# EAGLE design Hub_Teensy3_ElecImp_V002 (EAGLE 6.4)
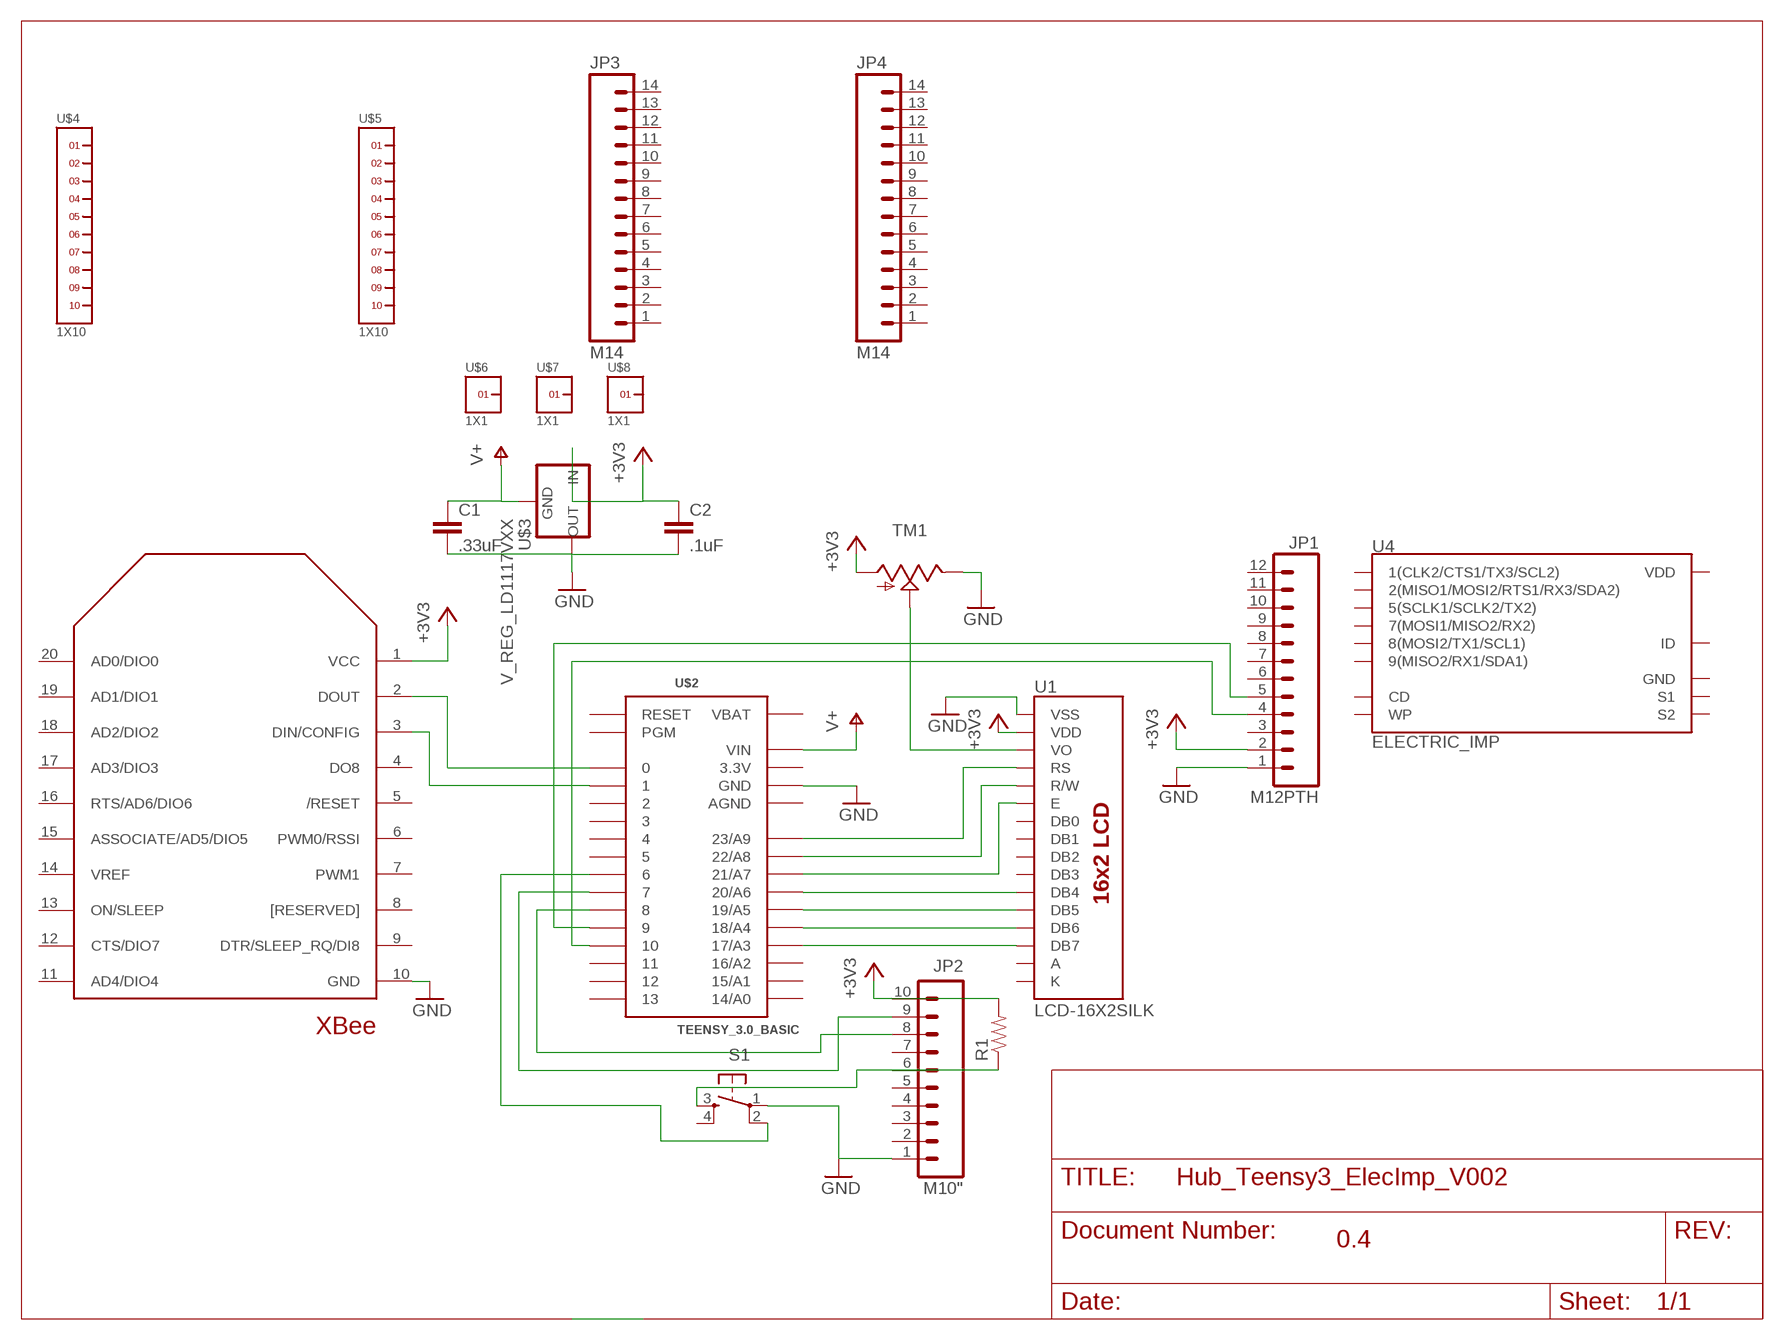
[diagram p0: schematic, sheet 1]

## Parts
C1  .33uF  1UF-25V-10%(0805)  [0805]
C2  .1uF  1UF-25V-10%(0805)  [0805]
JP1  M12PTH  [1X12]
JP2  M10"  [1X10]
JP3  M14  [1X14]
JP4  M14  [1X14]
R1  RESISTORPTH-1/4W  [AXIAL-0.4]
S1  TAC_SWITCHPTH  [TACTILE-PTH]
TM1  TRIM  [6MM]
U1  LCD-16X2SILK  [LCD-16X2]
U4  ELECTRIC_IMP  [SD_MMC_SOCKET]
U$1  XBEE  [XBEE]
U$2  TEENSY_3.0_BASIC  [TEENSY_3.0_BASIC]
U$3  V_REG_LD1117VXX  [78XXL]
U$4  1X10  [1X10]
U$5  1X10  [1X10]
U$6  1X1  [1X1]
U$7  1X1  [1X1]
U$8  1X1  [1X1]

## Nets
+3V3: C2.1 JP1.2 JP2.10 R1.P$2 TM1.A U1.2(VDD) U$1.1(VCC) U$3.OUT(IN)
GND: C1.2 C2.2 JP1.1 JP2.1 S1.1 TM1.E U1.1(VSS) U$1.10(GND) U$2.GND U$2.GND1(GND) U$3.GND(OUT)
N$1: U1.11(DB4) U$2.20/A6
N$2: U1.12(DB5) U$2.19/A5
N$3: U1.13(DB6) U$2.18/A4
N$4: U1.6(E) U$2.21/A7
N$5: U1.4(RS) U$2.23/A9
N$6: U1.5(R/W) U$2.22/A8
N$8: JP1.5 U$2.9
N$9: JP1.4 U$2.10
N$10: U1.14(DB7) U$2.17/A3
N$11: JP2.8 U$2.8
N$12: U$1.3(DIN/CONFIG) U$2.1
N$13: JP2.9 U$2.7
N$14: TM1.S U1.3(VO)
N$17: U$1.2(DOUT) U$2.0
N$19: JP2.6 R1.P$1 S1.3
N$20: S1.2 U$2.6
V+: C1.1 U$2.VIN U$3.IN(GND)
Unconnected: JP1.3 JP1.6 JP1.7 JP1.8 JP1.9 JP1.10 JP1.11 JP1.12 JP2.2 JP2.3 JP2.4 JP2.5 JP2.7 JP3.1 JP3.2 JP3.3 JP3.4 JP3.5 JP3.6 JP3.7 JP3.8 JP3.9 JP3.10 JP3.11 JP3.12 JP3.13 JP3.14 JP4.1 JP4.2 JP4.3 JP4.4 JP4.5 JP4.6 JP4.7 JP4.8 JP4.9 JP4.10 JP4.11 JP4.12 JP4.13 JP4.14 S1.4 U1.7(DB0) U1.8(DB1) U1.9(DB2) U1.10(DB3) U4.1(1(CLK2/CTS1/TX3/SCL2)) U4.2(2(MISO1/MOSI2/RTS1/RX3/SDA2)) U4.3(GND) U4.4(VDD) U4.5(5(SCLK1/SCLK2/TX2)) U4.6(ID) U4.7(7(MOSI1/MISO2/RX2)) U4.8(8(MOSI2/TX1/SCL1)) U4.9(9(MISO2/RX1/SDA1)) U4.CD U4.S1 U4.S2 U4.WP U$1.4(DO8) U$1.5(/RESET) U$1.6(PWM0/RSSI) U$1.7(PWM1) U$1.8([RESERVED]) U$1.9(DTR/SLEEP_RQ/DI8) U$1.11(AD4/DIO4) U$1.12(CTS/DIO7) U$1.13(ON/SLEEP) U$1.14(VREF) U$1.15(ASSOCIATE/AD5/DIO5) U$1.16(RTS/AD6/DIO6) U$1.17(AD3/DIO3) U$1.18(AD2/DIO2) U$1.19(AD1/DIO1) U$1.20(AD0/DIO0) U$2.2 U$2.3 U$2.4 U$2.5 U$2.11 U$2.12 U$2.13 U$2.14/A0 U$2.15/A1 U$2.16/A2 U$2.PGM U$2.RESET U$4.1 U$4.2 U$4.3 U$4.4 U$4.5 U$4.6 U$4.7 U$4.8 U$4.9 U$4.10 U$5.1 U$5.2 U$5.3 U$5.4 U$5.5 U$5.6 U$5.7 U$5.8 U$5.9 U$5.10 U$6.1 U$7.1 U$8.1

## Notes on the sheet
- 0.4

## Power pins joined to a net without a drawn wire
3.3V: U$2.3.3V U$2.3.3V1(3.3V)
A: U1.15(A)
AGND: U$2.AGND
K: U1.16(K)
VBAT: U$2.VBAT

## Library data of the parts
C1 C2 = SparkFun-Capacitors:1UF-25V-10%(0805): CAP-08064; PROD_ID: CAP-08064; VALUE: 1uF
JP1 = SparkFun-Connectors:M12: Header 12 Standard 12-pin 0.1" header. Use with straight break away headers (SKU : PRT-00116), right angle break away headers (PRT-00553), swiss pins (PRT-00743), machine pins (PRT-00117), and female headers (PRT-00115).
JP2 = SparkFun-Connectors:M10: Header 10 Standard 10-pin 0.1" header. Use with straight break away headers (SKU : PRT-00116), right angle break away headers (PRT-00553), swiss pins (PRT-00743), machine pins (PRT-00117), and female headers (PRT-00115).
JP3 JP4 = SparkFun-Connectors:M14: Header 14 Standard 14-pin 0.1" header. Use with straight break away headers (SKU : PRT-00116), right angle break away headers (PRT-00553), swiss pins (PRT-00743), machine pins (PRT-00117), and female headers (PRT-00115).
R1 = SparkFun-Passives:RESISTOR: Resistor Basic schematic elements and footprints for 0603, 1206, and PTH resistors.
S1 = SparkFun-Electromechanical:TAC_SWITCH: Momentary Switch Button commonly used for reset or general input. Spark Fun Electronics SKU : COM-00097 SMT- SWCH-08247
TM1 = adafruit:TRIM
U1 = SparkFun-Displays:LCD-16X2: Standard text-only 16x2 parallel input LCD
U4 = SparkFun-RF:ELECTRIC_IMP: Electric Imp SD Socket This symbol matches the Electric Imp <https://www.sparkfun.com/products/11395> pinout to a 4UCONN SD MMC connector. The 4UCONN part number is 19646 <http://www.4uconnector.com/online/Itemadrawing.asp?fldseries=19646&seriesno_a=12>. See this part in action on the Electric Imp Breakout <https://www.sparkfun.com/products/11400>.
U$1 = CEDT:XBEE
U$2 = Teensy3-2.0:TEENSY_3.0_BASIC: Basic Teensy 3.0 with none of the 'inner' pins enabled. See '+4', 'AllAnalogPins", and 'AllPins' packages for additional pin holes, as needed.
U$3 = SparkFun-PowerIC:V_REG_LD1117VXX: LD1117VXX voltage regulator. We carry the 3.3V version (COM-00526) in TO-220 package.
U$4 U$5 = headers(2mm)(samtec):1X10
U$6-U$8 = headers(.1in):1X1

## Board
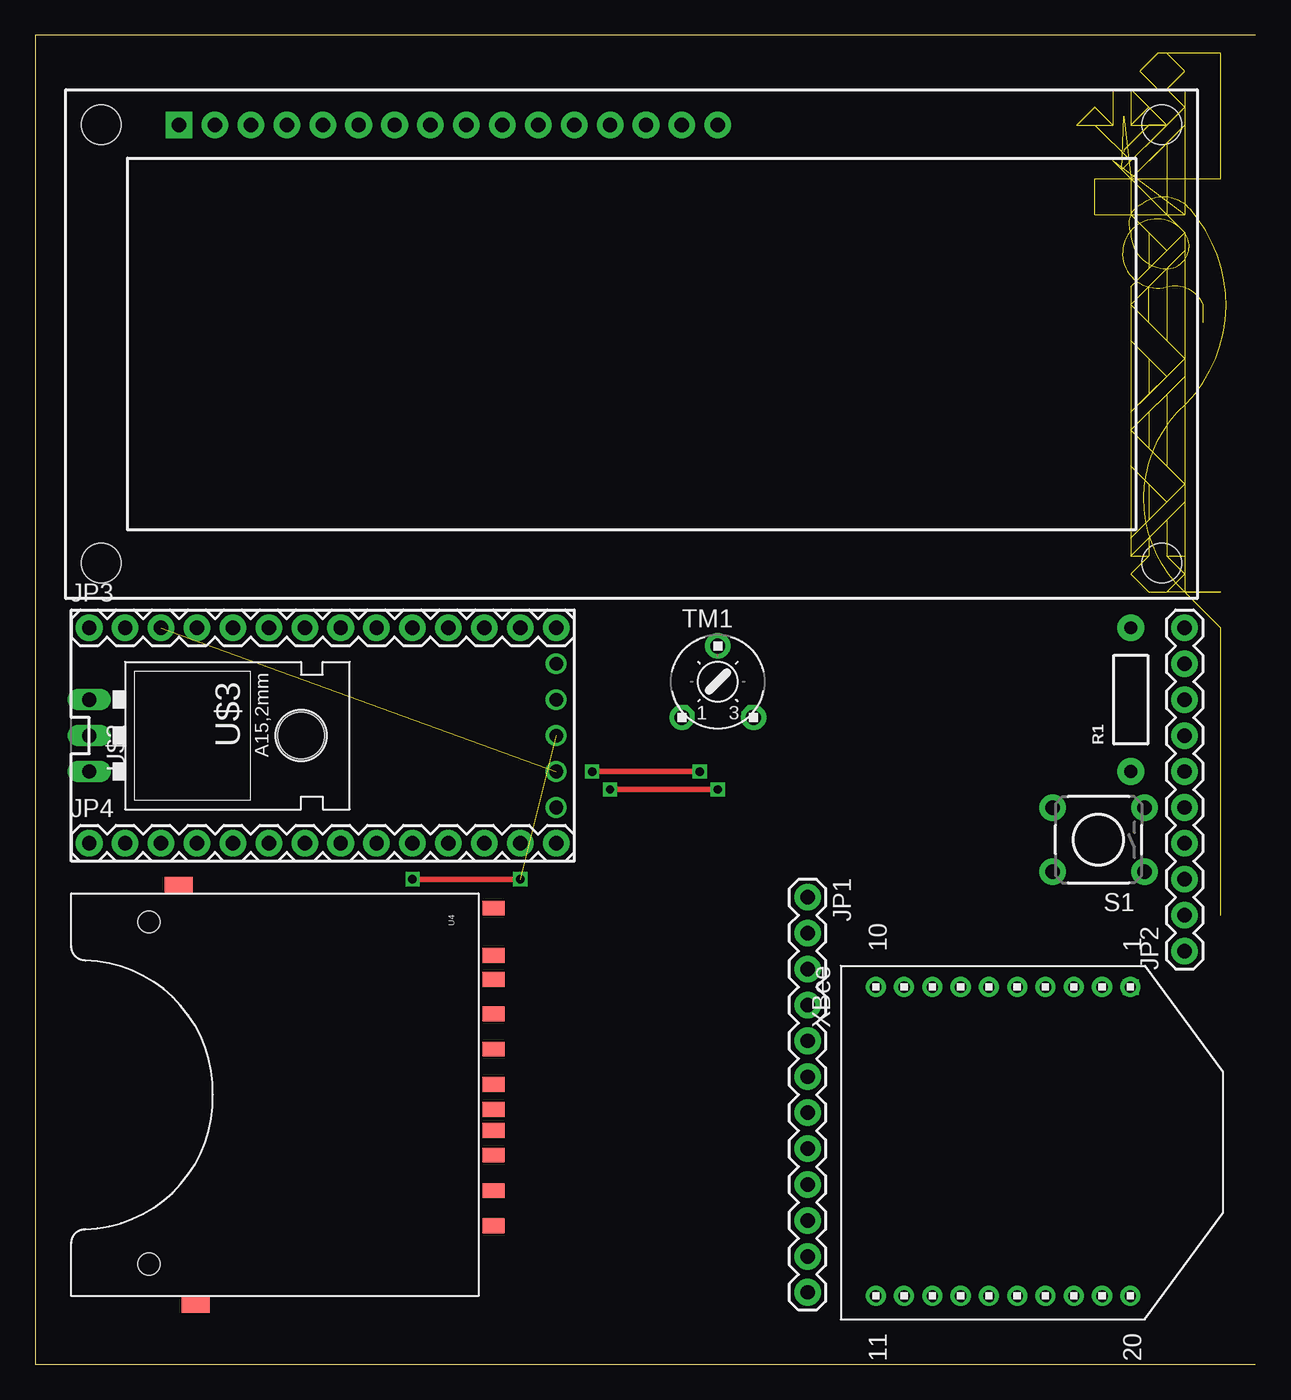
[diagram p1: board, top side]
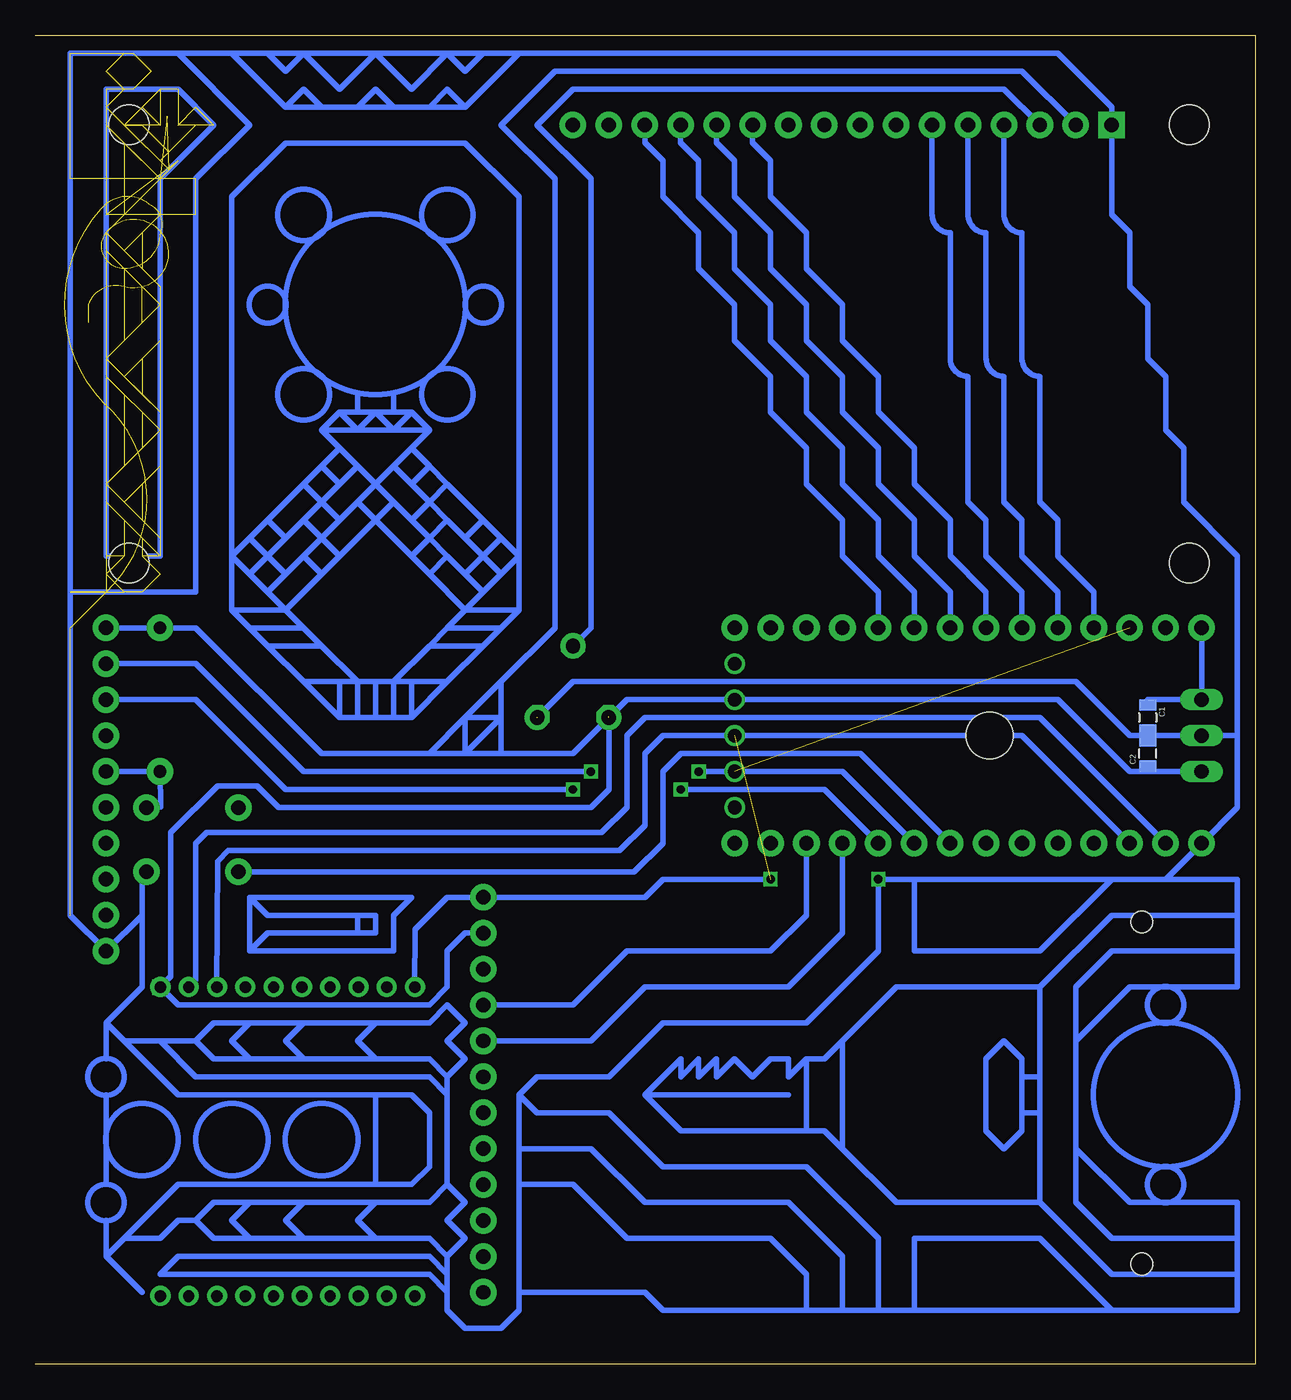
[diagram p2: board, bottom side, seen from below]

Size 86.28 x 93.97 mm. Coordinates in mm from the lower left corner, seen from the top.
Outline: 86.28,0 0,0 0,93.97 86.28,93.97
Copper layers (1*16): Top 0.035mm / dielectric 1.5mm / Bottom 0.035mm
Design rules "default": minimum track width 10mil, minimum drill 24mil, track to track 8mil, track to pad 8mil, pad to pad 8mil, via to via 8mil, smd to smd 8mil, copper to edge 40mil, drill to drill 8mil, minimum pad ring 10mil, minimum via ring 8mil, stop-mask expansion 4mil, vias tented up to drill 0mil, thermal gap 10mil

### Footprints (pad centres in the part's own frame; a part is rotated, then mirrored left to right if it is on the bottom)
0805 = smd 0.8 x 1.2: 1 -0.9,0; 2 0.9,0
1X12 = drill 1.016 pad 1.88: 1 0,0; 2 2.54,0; 3 5.08,0; 4 7.62,0; 5 10.16,0; 6 12.7,0; 7 15.24,0; 8 17.78,0; 9 20.32,0; 10 22.86,0; 11 25.4,0; 12 27.94,0
1X10 = drill 1.016 pad 1.88: 1 0,0; 2 2.54,0; 3 5.08,0; 4 7.62,0; 5 10.16,0; 6 12.7,0; 7 15.24,0; 8 17.78,0; 9 20.32,0; 10 22.86,0
1X14 = drill 1.016 pad 1.88: 1 0,0; 2 2.54,0; 3 5.08,0; 4 7.62,0; 5 10.16,0; 6 12.7,0; 7 15.24,0; 8 17.78,0; 9 20.32,0; 10 22.86,0; 11 25.4,0; 12 27.94,0; 13 30.48,0; 14 33.02,0
AXIAL-0.4 = drill 0.9 pad 1.88: P$1 -5.08,0; P$2 5.08,0
TACTILE-PTH = drill 1.016 pad 1.88: 1 -3.251,2.261; 2 3.251,2.261; 3 -3.251,-2.261; 4 3.251,-2.261
6MM = drill 1 pad 1.676 octagon: A -2.5,-2.5; E 2.5,-2.5; S 0,2.5
LCD-16X2 = drill 1.016 pad 1.88 square: 1 -32,15.5 | drill 1.016 pad 1.88: 2 -29.46,15.5; 3 -26.92,15.5; 4 -24.38,15.5; 5 -21.84,15.5; 6 -19.3,15.5; 7 -16.76,15.5; 8 -14.22,15.5; 9 -11.68,15.5; 10 -9.14,15.5; 11 -6.6,15.5; 12 -4.06,15.5; 13 -1.52,15.5; 14 1.02,15.5; 15 3.56,15.5; 16 6.1,15.5 | hole 2.8: -37.5,15.5; -37.5,-15.5; 37.5,15.5; 37.5,-15.5
SD_MMC_SOCKET = smd 1.05 x 1.56: 1 6.77,29.87; 2 4.27,29.87; 3 2.52,29.87; 4 -0.73,29.87; 5 -3.23,29.87; 6 -5.73,29.87; 7 -8.15,29.87; 8 -9.85,29.87; 9 9.27,29.87; CD 1.02,29.87; WP -13.2,29.87 | smd 1.2 x 2: S1 -14.8,7.6; S2 14.8,8.8 | hole 1.55: 11.98,5.5; -12.22,5.5
XBEE = drill 0.6 square: 1 0,0 | drill 0.6: 2 0,-2; 3 0,-4; 4 0,-6; 5 0,-8; 6 0,-10; 7 0,-12; 8 0,-14; 9 0,-16; 10 0,-18; 11 22,-18; 12 22,-16; 13 22,-14; 14 22,-12; 15 22,-10; 16 22,-8; 17 22,-6; 18 22,-4; 19 22,-2; 20 22,0
TEENSY_3.0_BASIC = drill 0.965: 0 -7.62,13.97; 1 -7.62,11.43; 2 -7.62,8.89; 3 -7.62,6.35; 3.3V 7.62,11.43; 3.3V1 -2.54,-16.51; 4 -7.62,3.81; 5 -7.62,1.27; 6 -7.62,-1.27; 7 -7.62,-3.81; 8 -7.62,-6.35; 9 -7.62,-8.89; 10 -7.62,-11.43; 11 -7.62,-13.97; 12 -7.62,-16.51; 13 7.62,-16.51; 14/A0 7.62,-13.97; 15/A1 7.62,-11.43; 16/A2 7.62,-8.89; 17/A3 7.62,-6.35; 18/A4 7.62,-3.81; 19/A5 7.62,-1.27; 20/A6 7.62,1.27; 21/A7 7.62,3.81; 22/A8 7.62,6.35; 23/A9 7.62,8.89; AGND 7.62,13.97; GND -7.62,16.51; GND1 0,-16.51; PGM 2.54,-16.51; RESET 5.08,-16.51; VBAT -5.08,-16.51; VIN 7.62,16.51
78XXL = drill 1.016 long: GND 0,-3.81; IN -2.54,-3.81; OUT 2.54,-3.81 | hole 3.302: 0,11.176
1X10' = drill 0.8 pad 1.422: 1 0,0; 2 2,0; 3 4,0; 4 6,0; 5 8,0; 6 10,0; 7 12,0; 8 14,0; 9 16,0; 10 18,0
1X1 = drill 1.016 pad 1.778: 1 0,0

### Placement (x,y rotation side)
C1  7.62,45.72 270 bottom
C2  7.62,43.18 90 bottom
JP1  54.61,33.02 270 top
JP2  81.28,29.21 90 top
JP3  3.81,52.07 0 top
JP4  3.81,36.83 0 top
R1  77.47,46.99 90 top
S1  75.18,37.08 180 top
TM1  48.26,48.26 0 top
U1  42.16,72.14 0 top
U4  2.54,19.05 270 top
U$1  77.47,26.67 270 top
U$2  20.32,44.45 90 top
U$3  7.62,44.45 270 top
U$4  1X10  [1X10']  59.44,26.67 0 top
U$5  1X10  [1X10']  59.44,4.83 0 top
U$6  48.26,50.8 0 top
U$7  50.8,45.72 0 top
U$8  45.72,45.72 0 top

### Tracks (layer width: path | path; a pad name or v marks a point on that pad's centre or on a via)
3.3V  (1 unrouted)
+3V3  (1 unrouted)
  Bottom 0.406: JP1.2 55.88,30.48 57.15,29.21 57.15,26.67 58.42,25.4 76.2,25.4 U$1.1 76.71,27.43 76.71,37.59 73.41,40.89 70.61,40.89 69.09,39.37 46.99,39.37 45.72,40.64 45.72,45.72 | U1.2 16.51,91.44 49.53,91.44 53.34,87.63 49.53,83.82 49.53,52.07 53.34,48.26 | JP2.10 R1.P$2 74.93,52.07 66.04,43.18 58.42,43.18 | 45.72,45.72 44.45,46.99 13.97,46.99 8.89,41.91 U$3.OUT 7.62,41.91 C2.1 | 45.72,45.72 48.26,43.18 53.34,43.18 | 53.34,43.18 55.88,43.18 | 55.88,43.18 58.42,43.18 | 53.34,48.26 53.34,45.72 | 53.34,45.72 53.34,43.18 | 53.34,48.26 55.88,45.72 | 55.88,45.72 58.42,43.18 | 53.34,45.72 55.88,45.72 | 55.88,45.72 55.88,43.18 | 55.88,43.18 53.34,45.72
GND  (via drill 0.6)  (124 unrouted)
  Top 0.406: v26.67,34.29 v34.29,34.29
  Bottom 0.406: U$1.10 59.44,30.73 57.15,33.02 JP1.1 43.18,33.02 41.91,34.29 v34.29,34.29 | 6.35,34.29 U$2.GND 1.27,39.37 1.27,44.45 | 6.35,34.29 10.16,34.29 | 10.16,34.29 24.13,34.29 | 24.13,34.29 v26.67,34.29 26.67,29.21 31.75,24.13 41.91,24.13 45.72,20.32 50.8,20.32 52.07,19.05 | U1.1 10.16,81.28 8.89,80.01 8.89,76.2 7.62,74.93 7.62,71.12 6.35,69.85 6.35,66.04 5.08,64.77 5.08,60.96 1.27,57.15 1.27,44.45 | 1.27,44.45 U$3.GND 7.62,44.45 | 77.47,22.86 74.93,20.32 58.42,20.32 57.15,19.05 | 52.07,5.08 52.07,3.81 53.34,2.54 55.88,2.54 57.15,3.81 57.15,5.08 | 52.07,5.08 52.07,12.7 | 52.07,12.7 52.07,15.24 | 52.07,15.24 52.07,19.05 | S1.1 78.74,34.01 78.74,31.75 | C2.2 7.62,44.45 | 7.62,44.45 C1.2 | 7.62,44.45 8.89,44.45 12.7,48.26 48.26,48.26 50.8,45.72 | 78.74,31.75 78.74,26.67 81.28,24.13 | 57.15,19.05 57.15,12.7 | 57.15,12.7 55.88,11.43 57.15,10.16 55.88,8.89 57.15,7.62 | 57.15,12.7 58.42,11.43 62.23,11.43 | 62.23,11.43 67.31,11.43 | 67.31,8.89 62.23,8.89 | 62.23,8.89 58.42,8.89 57.15,7.62 | 67.31,11.43 68.58,10.16 67.31,8.89 | 62.23,11.43 63.5,10.16 62.23,8.89 | 67.31,11.43 71.12,11.43 | 71.12,11.43 72.39,10.16 71.12,8.89 | 71.12,8.89 67.31,8.89 | 71.12,11.43 73.66,11.43 74.93,10.16 | 74.93,10.16 73.66,8.89 71.12,8.89 | 57.15,5.08 57.15,6.35 | 57.15,6.35 57.15,7.62 | 57.15,6.35 58.42,7.62 76.2,7.62 77.47,6.35 58.42,6.35 57.15,5.08 | 74.93,10.16 76.2,10.16 77.47,8.89 80.01,8.89 | 62.23,24.13 58.42,24.13 57.15,25.4 55.88,24.13 57.15,22.86 55.88,21.59 57.15,20.32 | 62.23,24.13 67.31,24.13 | 67.31,21.59 62.23,21.59 | 62.23,21.59 58.42,21.59 57.15,20.32 | 67.31,24.13 68.58,22.86 67.31,21.59 | 62.23,24.13 63.5,22.86 62.23,21.59
  Bottom 0.406: 67.31,24.13 71.12,24.13 | 71.12,24.13 72.39,22.86 71.12,21.59 | 71.12,21.59 67.31,21.59 | 71.12,24.13 73.66,24.13 74.93,22.86 | 74.93,22.86 73.66,21.59 71.12,21.59 | 74.93,22.86 77.47,22.86 | 62.23,12.7 59.69,12.7 58.42,13.97 58.42,17.78 59.69,19.05 62.23,19.05 | 62.23,12.7 76.2,12.7 80.01,8.89 | 80.01,8.89 81.28,7.62 | 81.28,24.13 80.01,22.86 | 80.01,22.86 76.2,19.05 62.23,19.05 | 62.23,19.05 62.23,12.7 | 81.28,24.13 81.28,21.59 | 81.28,10.16 81.28,7.62 | 78.74,5.08 81.28,7.62 | 77.47,22.86 80.01,22.86 | 78.74,31.75 JP2.1 83.82,31.75 83.82,54.61 | 57.15,20.32 57.15,19.05 | 83.82,54.61 83.82,92.71 76.2,92.71 | 76.2,92.71 71.12,87.63 74.93,83.82 74.93,54.61 83.82,54.61 | 52.07,92.71 55.88,88.9 | 55.88,88.9 58.42,88.9 | 58.42,88.9 60.96,88.9 | 60.96,88.9 63.5,88.9 | 63.5,88.9 66.04,88.9 | 66.04,88.9 68.58,88.9 | 68.58,88.9 72.39,92.71 | 72.39,92.71 69.85,92.71 | 69.85,92.71 67.31,92.71 | 67.31,92.71 62.23,92.71 | 62.23,92.71 57.15,92.71 | 57.15,92.71 54.61,92.71 | 54.61,92.71 52.07,92.71 | 52.07,92.71 13.97,92.71 10.16,88.9 U1.1 | 72.39,92.71 76.2,92.71 | 54.61,92.71 55.88,91.44 57.15,92.71 | 57.15,92.71 59.69,90.17 62.23,92.71 | 62.23,92.71 64.77,90.17 67.31,92.71 | 67.31,92.71 68.58,91.44 69.85,92.71 | 55.88,88.9 57.15,90.17 58.42,88.9 | 60.96,88.9 62.23,90.17 63.5,88.9 | 66.04,88.9 67.31,90.17 68.58,88.9 | 52.07,19.05 50.8,17.78 45.72,17.78 41.91,13.97 31.75,13.97 26.67,8.89 26.67,3.81 | 52.07,15.24 46.99,15.24 43.18,11.43 33.02,11.43 29.21,7.62 29.21,3.81 | 52.07,12.7 48.26,12.7 44.45,8.89 34.29,8.89 31.75,6.35 31.75,3.81 | 10.16,34.29 15.24,29.21 24.13,29.21 24.13,34.29 | 6.35,34.29 1.27,34.29 1.27,26.67 8.89,26.67 12.7,22.86
  Bottom 0.406: 10.16,3.81 1.27,3.81 1.27,11.43 8.89,11.43 12.7,15.24 | 10.16,3.81 15.24,8.89 24.13,8.89 24.13,3.81 | 1.27,29.21 10.16,29.21 12.7,26.67 12.7,22.86 | 1.27,8.89 10.16,8.89 12.7,11.43 12.7,15.24 | 12.7,22.86 12.7,15.24 | 10.16,3.81 41.91,3.81 43.18,5.08 52.07,5.08 | 81.28,90.17 81.28,57.15 77.47,57.15 77.47,83.82 73.66,87.63 76.2,90.17 81.28,90.17
N$1
  Bottom 0.406: U$2.20/A6 19.05,54.61 21.59,57.15 21.59,59.69 24.13,62.23 24.13,64.77 26.67,67.31 26.67,69.85 29.21,72.39 29.21,74.93 31.75,77.47 31.75,80.01 34.29,82.55 34.29,85.09 35.56,86.36 U1.11
N$2
  Bottom 0.406: U$2.19/A5 21.59,54.61 24.13,57.15 24.13,59.69 26.67,62.23 26.67,64.77 29.21,67.31 29.21,69.85 31.75,72.39 31.75,74.93 34.29,77.47 34.29,80.01 36.83,82.55 36.83,85.09 38.1,86.36 U1.12
N$3
  Bottom 0.406: U$2.18/A4 24.13,54.61 26.67,57.15 26.67,59.69 29.21,62.23 29.21,64.77 31.75,67.31 31.75,69.85 34.29,72.39 34.29,74.93 36.83,77.47 36.83,80.01 39.37,82.55 39.37,85.09 40.64,86.36 U1.13
N$4
  Bottom 0.406: U$2.21/A7 16.51,54.61 19.05,57.15 19.05,59.69 20.32,60.96 20.32,69.85 arc90 21.59,71.12 21.59,80.01 arc90 22.86,81.28 U1.6
N$5
  Bottom 0.406: U$2.23/A9 11.43,54.61 13.97,57.15 13.97,59.69 15.24,60.96 15.24,69.85 arc90 16.51,71.12 16.51,80.01 arc90 17.78,81.28 U1.4
N$6
  Bottom 0.406: U$2.22/A8 13.97,54.61 16.51,57.15 16.51,59.69 17.78,60.96 17.78,69.85 arc90 19.05,71.12 19.05,80.01 arc90 20.32,81.28 U1.5
N$8
  Bottom 0.406: U$2.9 29.21,30.48 33.02,26.67 43.18,26.67 46.99,22.86 JP1.5
N$9
  Bottom 0.406: JP1.4 48.26,25.4 44.45,29.21 34.29,29.21 31.75,31.75 U$2.10
N$10
  Bottom 0.406: U$2.17/A3 26.67,54.61 29.21,57.15 29.21,59.69 31.75,62.23 31.75,64.77 34.29,67.31 34.29,69.85 36.83,72.39 36.83,74.93 39.37,77.47 39.37,80.01 41.91,82.55 41.91,85.09 43.18,86.36 U1.14
N$11  (via drill 0.6)
  Top 0.406: v40.64,40.64 v48.26,40.64
  Bottom 0.406: U$2.8 30.48,40.64 v40.64,40.64 | JP2.8 74.93,46.99 68.58,40.64 v48.26,40.64
N$12
  Bottom 0.406: U$2.1 16.51,44.45 41.91,44.45 43.18,43.18 43.18,38.1 44.96,36.32 72.64,36.32 73.41,35.56 U$1.3
N$13  (via drill 0.6)
  Top 0.406: v39.37,41.91 v46.99,41.91
  Bottom 0.406: U$2.7 29.21,41.91 v39.37,41.91 | v46.99,41.91 67.31,41.91 74.93,49.53 JP2.9
N$14
  Bottom 0.406: U1.3 17.78,90.17 48.26,90.17 50.8,87.63 46.99,83.82 46.99,52.07 TM1.S
N$17
  Bottom 0.406: U$1.2 74.93,27.18 74.93,36.83 74.17,37.59 46.23,37.59 44.45,39.37 44.45,44.45 43.18,45.72 15.24,45.72 U$2.0
N$18
  Bottom 0.406: 71.12,33.02 59.69,33.02 60.96,31.75 60.96,29.21 71.12,29.21 | 71.12,33.02 71.12,29.21 | 63.5,30.48 62.23,30.48 62.23,31.75 63.5,31.75 | 63.5,30.48 69.85,30.48 71.12,29.21 | 71.12,33.02 69.85,31.75 63.5,31.75 | 63.5,31.75 63.5,30.48
N$19
  Bottom 0.406: JP2.6 R1.P$1 77.42,39.42 S1.3
N$20
  Bottom 0.406: U$2.6 27.94,43.18 40.64,43.18 41.91,41.91 41.91,36.83 43.94,34.8 50.11,34.8 S1.2
N$21
  Bottom 0.406: 58.42,66.04 59.69,67.31 | 59.69,67.31 60.96,67.31 | 60.96,67.31 62.23,67.31 | 62.23,67.31 63.5,67.31 | 63.5,67.31 64.77,67.31 | 64.77,67.31 66.04,66.04 | 66.04,66.04 64.77,64.77 | 64.77,64.77 63.5,63.5 | 63.5,63.5 62.23,62.23 | 62.23,62.23 60.96,63.5 | 60.96,63.5 59.69,64.77 | 59.69,64.77 58.42,66.04 | 58.42,66.04 60.96,66.04 | 60.96,66.04 63.5,66.04 | 63.5,66.04 66.04,66.04 | 59.69,67.31 60.96,66.04 | 60.96,66.04 62.23,67.31 | 62.23,67.31 63.5,66.04 | 63.5,66.04 64.77,67.31 | 64.77,45.72 67.31,48.26 | 67.31,48.26 69.85,50.8 | 69.85,50.8 71.12,52.07 | 71.12,52.07 72.39,53.34 | 72.39,53.34 72.39,57.15 | 72.39,57.15 72.39,82.55 68.58,86.36 55.88,86.36 52.07,82.55 52.07,57.15 | 52.07,57.15 52.07,53.34 | 52.07,53.34 53.34,52.07 | 53.34,52.07 54.61,50.8 | 54.61,50.8 57.15,48.26 | 57.15,48.26 59.69,45.72 | 59.69,45.72 60.96,45.72 | 60.96,45.72 62.23,45.72 | 62.23,45.72 63.5,45.72 | 63.5,45.72 64.77,45.72 | 52.07,53.34 55.88,53.34 | 55.88,53.34 57.15,52.07 | 57.15,52.07 58.42,50.8 | 58.42,50.8 60.96,48.26 | 60.96,48.26 62.23,48.26 | 62.23,48.26 63.5,48.26 | 63.5,48.26 66.04,50.8 | 66.04,50.8 67.31,52.07 | 67.31,52.07 68.58,53.34 | 68.58,53.34 72.39,53.34 | 59.69,64.77 58.42,63.5 | 58.42,63.5 57.15,62.23 | 57.15,62.23 54.61,59.69 | 54.61,59.69 53.34,58.42 | 53.34,58.42 52.07,57.15 | 52.07,57.15 53.34,55.88 | 53.34,55.88 54.61,54.61 | 54.61,54.61 55.88,53.34 | 68.58,53.34 69.85,54.61 | 69.85,54.61 71.12,55.88 | 71.12,55.88 72.39,57.15 | 72.39,57.15 71.12,58.42 | 71.12,58.42 69.85,59.69 | 69.85,59.69 67.31,62.23 | 67.31,62.23 66.04,63.5 | 66.04,63.5 64.77,64.77 | 63.5,63.5 64.77,62.23 | 64.77,62.23 66.04,60.96 | 66.04,60.96 67.31,59.69 | 67.31,59.69 68.58,58.42 | 68.58,58.42 69.85,57.15
  Bottom 0.406: 69.85,57.15 71.12,55.88 | 69.85,54.61 68.58,55.88 | 68.58,55.88 67.31,57.15 | 67.31,57.15 66.04,58.42 | 66.04,58.42 64.77,59.69 | 64.77,59.69 63.5,60.96 | 63.5,60.96 62.23,62.23 | 62.23,62.23 60.96,60.96 | 60.96,60.96 59.69,59.69 | 59.69,59.69 58.42,58.42 | 58.42,58.42 57.15,57.15 | 57.15,57.15 55.88,55.88 | 55.88,55.88 54.61,54.61 | 53.34,55.88 54.61,57.15 | 54.61,57.15 55.88,58.42 | 55.88,58.42 57.15,59.69 | 57.15,59.69 58.42,60.96 | 58.42,60.96 59.69,62.23 | 59.69,62.23 60.96,63.5 | 55.88,53.34 58.42,55.88 | 58.42,55.88 59.69,57.15 | 59.69,57.15 62.23,59.69 | 62.23,59.69 64.77,57.15 | 64.77,57.15 66.04,55.88 | 66.04,55.88 68.58,53.34 | 53.34,52.07 57.15,52.07 | 54.61,50.8 58.42,50.8 | 57.15,48.26 59.69,48.26 | 59.69,48.26 60.96,48.26 | 59.69,48.26 59.69,45.72 | 60.96,48.26 60.96,45.72 | 62.23,48.26 62.23,45.72 | 63.5,48.26 63.5,45.72 | 63.5,48.26 64.77,48.26 | 64.77,48.26 67.31,48.26 | 64.77,48.26 64.77,45.72 | 67.31,52.07 71.12,52.07 | 66.04,50.8 69.85,50.8 | 62.23,59.69 60.96,60.96 | 62.23,59.69 63.5,60.96 | 64.77,57.15 66.04,58.42 | 66.04,55.88 67.31,57.15 | 59.69,57.15 58.42,58.42 | 58.42,55.88 57.15,57.15 | 58.42,60.96 59.69,59.69 | 58.42,58.42 57.15,59.69 | 55.88,55.88 54.61,57.15 | 59.69,62.23 58.42,63.5 | 58.42,60.96 57.15,62.23 | 55.88,58.42 54.61,59.69 | 54.61,57.15 53.34,58.42 | 64.77,62.23 66.04,63.5 | 66.04,60.96 67.31,62.23 | 71.12,58.42 69.85,57.15 | 69.85,59.69 68.58,58.42 | 66.04,60.96 64.77,59.69 | 67.31,59.69 66.04,58.42 | 69.85,57.15 68.58,55.88 | 63.5,68.58 63.5,67.31 | 60.96,68.58 60.96,67.31
N$22
  Bottom 0.406: 81.28,19.05 81.28,12.7
N$29
  Bottom 0.406: 1.27,31.75 10.16,31.75 15.24,26.67 | 1.27,6.35 10.16,6.35 15.24,11.43 | 29.21,22.86 25.4,26.67 15.24,26.67 | 29.21,15.24 25.4,11.43 15.24,11.43 | 15.24,26.67 15.24,20.32 | 15.24,20.32 15.24,17.78 | 15.24,17.78 15.24,11.43 | 29.21,22.86 29.21,15.24 | 31.75,21.59 31.75,16.51 | 31.75,16.51 40.64,16.51 43.18,19.05 | 43.18,19.05 40.64,21.59 40.64,20.32 39.37,21.59 39.37,20.32 38.1,21.59 38.1,20.32 36.83,21.59 35.56,20.32 34.29,21.59 33.02,21.59 33.02,20.32 31.75,21.59 | 29.21,15.24 30.48,16.51 31.75,16.51 | 31.75,21.59 30.48,21.59 29.21,22.86 | 43.18,19.05 33.02,19.05 | 16.51,20.32 16.51,21.59 17.78,22.86 19.05,21.59 19.05,16.51 17.78,15.24 16.51,16.51 16.51,17.78 | 16.51,20.32 16.51,17.78 | 15.24,20.32 16.51,20.32 | 15.24,17.78 16.51,17.78
V+
  Bottom 0.406: U$2.VIN U$3.IN 7.62,46.99 C1.1
(copper drawn outside any net)
  shapes: Bottom circle x15